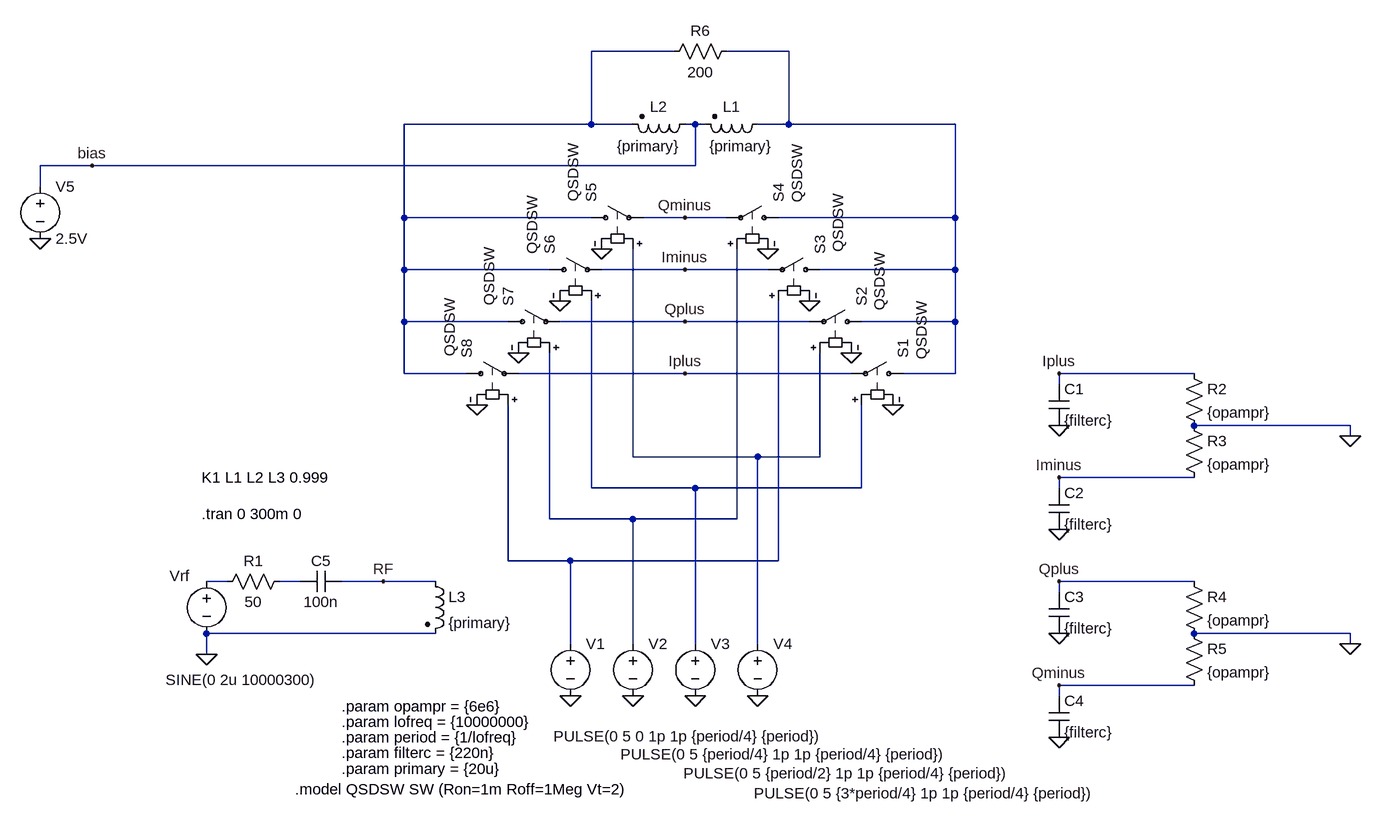
[diagram p0: schematic QSD-differential.asc]
QSD-differential.asc, the LTspice schematic file:
Version 4
SHEET 1 1652 844
WIRE 592 -336 464 -336
WIRE 768 -336 672 -336
WIRE 464 -224 464 -336
WIRE 464 -224 176 -224
WIRE 528 -224 464 -224
WIRE 624 -224 608 -224
WIRE 640 -224 624 -224
WIRE 768 -224 768 -336
WIRE 768 -224 720 -224
WIRE 1024 -224 768 -224
WIRE -304 -160 -384 -160
WIRE 624 -160 624 -224
WIRE 624 -160 -304 -160
WIRE -384 -128 -384 -160
WIRE 176 -80 176 -224
WIRE 464 -80 176 -80
WIRE 608 -80 544 -80
WIRE 672 -80 608 -80
WIRE 1024 -80 1024 -224
WIRE 1024 -80 752 -80
WIRE 176 0 176 -80
WIRE 400 0 176 0
WIRE 608 0 480 0
WIRE 736 0 608 0
WIRE 1024 0 1024 -80
WIRE 1024 0 816 0
WIRE 176 80 176 0
WIRE 336 80 176 80
WIRE 608 80 416 80
WIRE 800 80 608 80
WIRE 1024 80 1024 0
WIRE 1024 80 880 80
WIRE 176 160 176 80
WIRE 272 160 176 160
WIRE 608 160 352 160
WIRE 864 160 608 160
WIRE 1024 160 1024 80
WIRE 1024 160 944 160
WIRE 1392 160 1184 160
WIRE 1184 176 1184 160
WIRE 1632 240 1392 240
WIRE 1632 256 1632 240
WIRE 528 288 528 -32
WIRE 720 288 528 288
WIRE 816 288 816 128
WIRE 816 288 720 288
WIRE 1392 320 1184 320
WIRE 464 336 464 48
WIRE 624 336 464 336
WIRE 880 336 880 208
WIRE 880 336 624 336
WIRE 1184 336 1184 320
WIRE 400 384 400 128
WIRE 528 384 400 384
WIRE 688 384 688 -32
WIRE 688 384 528 384
WIRE 336 448 336 208
WIRE 432 448 336 448
WIRE 752 448 752 48
WIRE 752 448 432 448
WIRE -96 480 -128 480
WIRE 16 480 -16 480
WIRE 144 480 80 480
WIRE 224 480 144 480
WIRE 1392 480 1184 480
WIRE 1184 496 1184 480
WIRE 224 560 -128 560
WIRE 1632 560 1392 560
WIRE 432 576 432 448
WIRE 528 576 528 384
WIRE 624 576 624 336
WIRE 720 576 720 288
WIRE 1632 576 1632 560
WIRE -128 592 -128 560
WIRE 1392 640 1184 640
WIRE 1184 656 1184 640
FLAG 432 656 0
FLAG 528 656 0
FLAG 624 656 0
FLAG 720 656 0
FLAG 288 208 0
FLAG 352 128 0
FLAG 416 48 0
FLAG 480 -32 0
FLAG 864 128 0
FLAG 928 208 0
FLAG 800 48 0
FLAG 736 -32 0
FLAG 608 160 Iplus
FLAG 608 0 Iminus
FLAG 608 80 Qplus
FLAG 608 -80 Qminus
FLAG -384 -48 0
FLAG -128 592 0
FLAG 144 480 RF
FLAG -304 -160 bias
FLAG 1184 640 Qminus
FLAG 1184 480 Qplus
FLAG 1184 160 Iplus
FLAG 1184 320 Iminus
FLAG 1184 560 0
FLAG 1184 720 0
FLAG 1184 240 0
FLAG 1184 400 0
FLAG 1632 256 0
FLAG 1632 576 0
SYMBOL ind2 736 -240 R90
WINDOW 0 5 56 VBottom 2
WINDOW 3 34 41 VTop 2
SYMATTR InstName L1
SYMATTR Value {primary}
SYMATTR Type ind
SYMBOL ind2 624 -240 R90
WINDOW 0 5 56 VBottom 2
WINDOW 3 34 72 VTop 2
SYMATTR InstName L2
SYMATTR Value {primary}
SYMATTR Type ind
SYMBOL ind2 208 464 R0
SYMATTR InstName L3
SYMATTR Value {primary}
SYMATTR Type ind
SYMBOL voltage 432 560 R0
WINDOW 3 -26 158 Left 2
WINDOW 123 0 0 Left 2
WINDOW 39 0 0 Left 2
SYMATTR Value PULSE(0 5 0 1p 1p {period/4} {period})
SYMATTR InstName V1
SYMBOL voltage 528 560 R0
WINDOW 3 -19 186 Left 2
SYMATTR Value PULSE(0 5 {period/4} 1p 1p {period/4} {period})
SYMATTR InstName V2
SYMBOL voltage 624 560 R0
WINDOW 3 -18 215 Left 2
SYMATTR Value PULSE(0 5 {period/2} 1p 1p {period/4} {period})
SYMATTR InstName V3
SYMBOL voltage 720 560 R0
WINDOW 3 -6 246 Left 2
SYMATTR Value PULSE(0 5 {3*period/4} 1p 1p {period/4} {period})
SYMATTR InstName V4
SYMBOL sw 960 160 M270
WINDOW 3 22 -12 Left 2
SYMATTR Value QSDSW
SYMATTR InstName S1
SYMBOL sw 896 80 M270
WINDOW 3 17 -12 Left 2
SYMATTR Value QSDSW
SYMATTR InstName S2
SYMBOL sw 832 0 M270
WINDOW 3 27 -12 Left 2
SYMATTR Value QSDSW
SYMATTR InstName S3
SYMBOL sw 768 -80 M270
WINDOW 3 23 -13 Left 2
SYMATTR Value QSDSW
SYMATTR InstName S4
SYMBOL sw 448 -80 R270
WINDOW 3 25 -12 Left 2
SYMATTR Value QSDSW
SYMATTR InstName S5
SYMBOL sw 384 0 R270
WINDOW 3 24 -11 Left 2
SYMATTR Value QSDSW
SYMATTR InstName S6
SYMBOL sw 320 80 R270
WINDOW 3 25 -13 Left 2
SYMATTR Value QSDSW
SYMATTR InstName S7
SYMBOL sw 256 160 R270
WINDOW 3 26 -10 Left 2
SYMATTR Value QSDSW
SYMATTR InstName S8
SYMBOL voltage -384 -144 R0
WINDOW 123 0 0 Left 2
WINDOW 39 0 0 Left 2
SYMATTR InstName V5
SYMATTR Value 2.5V
SYMBOL res 0 464 R90
WINDOW 0 0 56 VBottom 2
WINDOW 3 32 56 VTop 2
SYMATTR InstName R1
SYMATTR Value 50
SYMBOL res 1376 144 R0
SYMATTR InstName R2
SYMATTR Value {opampr}
SYMBOL res 1376 224 R0
SYMATTR InstName R3
SYMATTR Value {opampr}
SYMBOL res 1376 464 R0
SYMATTR InstName R4
SYMATTR Value {opampr}
SYMBOL res 1376 544 R0
SYMATTR InstName R5
SYMATTR Value {opampr}
SYMBOL cap 1168 176 R0
SYMATTR InstName C1
SYMATTR Value {filterc}
SYMBOL cap 1168 336 R0
SYMATTR InstName C2
SYMATTR Value {filterc}
SYMBOL cap 1168 496 R0
SYMATTR InstName C3
SYMATTR Value {filterc}
SYMBOL cap 1168 656 R0
SYMATTR InstName C4
SYMATTR Value {filterc}
SYMBOL voltage -128 464 R0
WINDOW 0 -57 7 Left 2
WINDOW 3 -63 167 Left 2
SYMATTR InstName Vrf
SYMATTR Value SINE(0 2u 10000300)
SYMATTR SpiceLine Rser=0
SYMBOL cap 80 464 R90
WINDOW 0 0 32 VBottom 2
WINDOW 3 32 32 VTop 2
SYMATTR InstName C5
SYMATTR Value 100n
SYMBOL res 688 -352 R90
WINDOW 0 0 56 VBottom 2
WINDOW 3 32 56 VTop 2
SYMATTR InstName R6
SYMATTR Value 200
TEXT -136 320 Left 2 !K1 L1 L2 L3 0.999
TEXT 80 720 Left 2 !.param period = {1/lofreq}
TEXT 80 696 Left 2 !.param lofreq = {10000000}
TEXT 80 744 Left 2 !.param filterc = {220n}
TEXT 8 800 Left 2 !.model QSDSW SW (Ron=1m Roff=1Meg Vt=2)
TEXT 80 768 Left 2 !.param primary = {20u}
TEXT -136 376 Left 2 !.tran 0 300m 0
TEXT 80 672 Left 2 !.param opampr = {6e6}

The netlist it stands for:
* QSD-differential.asc
L1 N002 bias {primary}
L2 bias N001 {primary}
L3 RF 0 {primary}
V1 N006 0 PULSE(0 5 0 1p 1p {period/4} {period})
V2 N005 0 PULSE(0 5 {period/4} 1p 1p {period/4} {period})
V3 N004 0 PULSE(0 5 {period/2} 1p 1p {period/4} {period})
V4 N003 0 PULSE(0 5 {3*period/4} 1p 1p {period/4} {period})
S1 N002 Iplus N004 0 QSDSW
S2 N002 Qplus N003 0 QSDSW
S3 N002 Iminus N006 0 QSDSW
S4 N002 Qminus N005 0 QSDSW
S5 N001 Qminus N003 0 QSDSW
S6 N001 Iminus N004 0 QSDSW
S7 N001 Qplus N005 0 QSDSW
S8 N001 Iplus N006 0 QSDSW
V5 bias 0 2.5V
R1 N008 N007 50
R2 Iplus 0 {opampr}
R3 0 Iminus {opampr}
R4 Qplus 0 {opampr}
R5 0 Qminus {opampr}
C1 Iplus 0 {filterc}
C2 Iminus 0 {filterc}
C3 Qplus 0 {filterc}
C4 Qminus 0 {filterc}
Vrf N007 0 SINE(0 2u 10000300) Rser=0
C5 RF N008 100n
R6 N002 N001 200
K1 L1 L2 L3 0.999
.param period = {1/lofreq}
.param lofreq = {10000000}
.param filterc = {220n}
.model QSDSW SW (Ron=1m Roff=1Meg Vt=2)
.param primary = {20u}
.tran 0 300m 0
.param opampr = {6e6}
.backanno
.end